# Altium schematic sheet [05] - POWER.SchDoc
size A3; CompanyName: FPT-FTI copporation; Address1: FPT Building Duy Tan; Address2: Floor 4,; DocumentNumber: 5; SheetNumber: 5; SheetTotal: 8; NameAuthor: Angle Vu
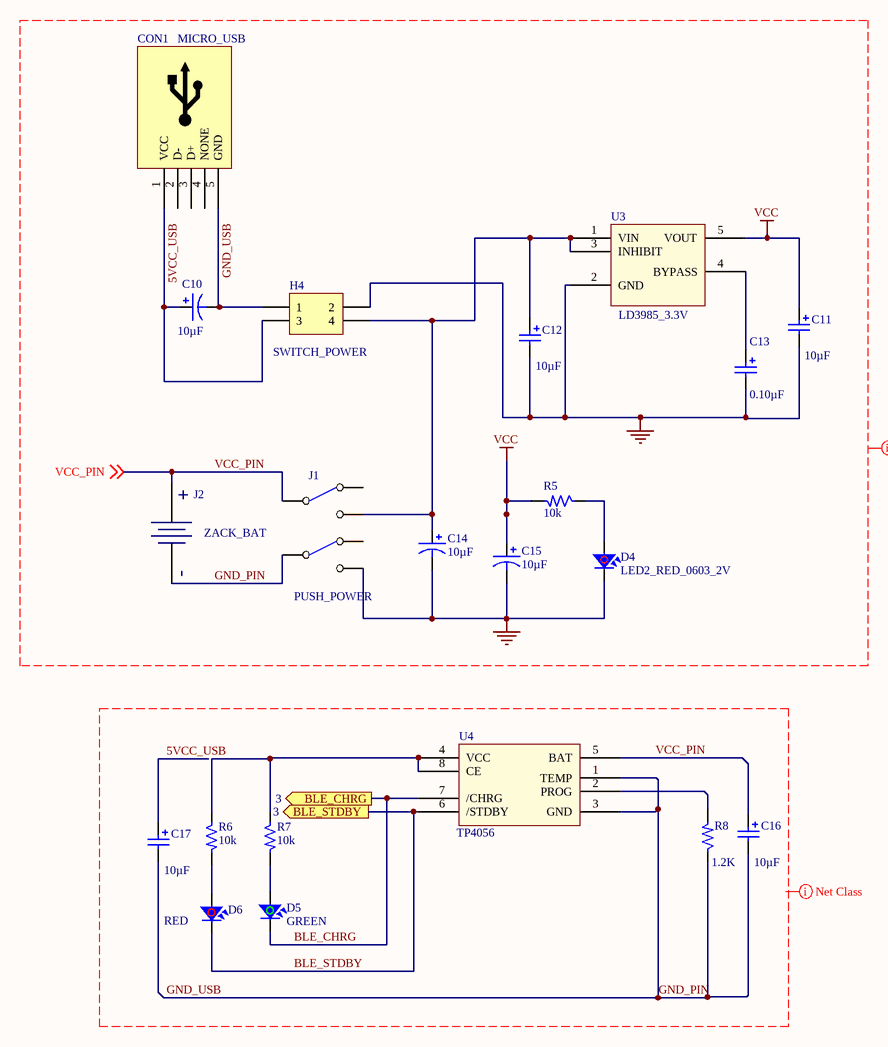
[diagram p0: [05] - POWER.SchDoc]

## Parts
C10  Capacitance: 10µF  [CAP_SMD0805 - TANTALUM]  (hidden comment: C_106_0805_TANTALUM_16V)
C11  Capacitance: 10µF  [CAP_SMD0805]  (hidden comment: C_106_0805_CERAMIC_16V)
C12  Capacitance: 10µF  [CAP_SMD0805]  (hidden comment: C_106_0805_CERAMIC_16V)
C13  Capacitance: 0.10µF  [CAP_SMD0603]  (hidden comment: C_104_0603_CERAMIC_16V)
C14  Capacitance: 10µF  [CAP_SMD0805 - TANTALUM]  (hidden comment: C_106_0805_TANTALUM_16V)
C15  Capacitance: 10µF  [CAP_SMD0805 - TANTALUM]  (hidden comment: C_106_0805_TANTALUM_16V)
C16  Capacitance: 10µF  [CAP_SMD0805]  (hidden comment: C_106_0805_CERAMIC_16V)
C17  Capacitance: 10µF  [CAP_SMD0805]  (hidden comment: C_106_0805_CERAMIC_16V)
CON1  MICRO_USB  [CON_MICRO_USB_HOLE]
D4  LED2_RED_0603_2V  [LED_RED_SMD0603]
D5  GREEN  [LED_GREEN_SMD0603]
D6  RED  [LED_RED_SMD0603]
H4  SWITCH_POWER  [HEADER2_MALE2_HOLE2.54]
J1  PUSH_POWER  [SW6_DPDT_POWER]
J2  ZACK_BAT  [ZACK_BAT]
R5  Resistance (Ohms): 10k  [RES_SMD0603]  (hidden comment: R_10K_SMD0603_1%_1/10W)
R6  Resistance (Ohms): 10k  [RES_SMD0603]  (hidden comment: R_10K_SMD0603_1%_1/10W)
R7  Resistance (Ohms): 10k  [RES_SMD0603]  (hidden comment: R_10K_SMD0603_1%_1/10W)
R8  Resistance (Ohms): 1.2K  [RES_SMD0603]  (hidden comment: R_1K2_SMD0603_1%_1/10W)
U3  LD3985_3.3V  [POWER_LDO_LDR3985-3.3]
U4  TP4056  [POWER__CHARGE_TP4056]

## Ports
BLE_CHRG (out, see 3), BLE_STDBY (out, see 3)

## Nets
GND: C11.2 C12.2 C13.2 C14.2 C15.2 D4.2 H4.2 J1.4(NO) U3.2(GND)
VCC: C11.1 C15.1 R5.2 U3.5(VOUT)
5VCC_USB: C10.1 C17.1 CON1.1(VCC) H4.3
BLE_CHRG: D5.2 U4.7(/CHRG) ; port BLE_CHRG
BLE_STDBY: D6.2 U4.6(/STDBY) ; port BLE_STDBY
GND_PIN: C10.2 C16.2 C17.2 CON1.5(GND) H4.1 J1.5(COMMON) J2.2(-) R8.1 U4.1(TEMP) U4.3(GND)  [also labelled GND_USB]
VCC_PIN: C16.1 J1.2(COMMON) J2.1(+) U4.5(BAT) ; off-sheet VCC_PIN
NetC12_1: C12.1 C14.1 H4.4 J1.3(NO) U3.1(VIN) U3.3(INHIBIT)
NetC13_1: C13.1 U3.4(BYPASS)
NetD4_1: D4.1 R5.1
NetD5_1: D5.1 R7.2
NetD6_1: D6.1 R6.2
NetR6_1: R6.1 R7.1 U4.4(VCC) U4.8(CE)
NetR8_2: R8.2 U4.2(PROG)

Not connected (* = marked no-connect by the designer): CON1 2(D-) 3(D+) 4(NONE); J1 1(NC) 6(NC)

## Layout directives
power charge: Undefined: 5VCC_USB, BLE_CHRG, BLE_STDBY, GND_PIN, GND_USB, VCC_PIN
power supply: Undefined: 5VCC_USB, GND, GND_PIN, GND_USB, VCC, VCC_PIN

## Notes on the sheet
- Designed By
- Checked By
- Company:
- Size:
- A3
- Address:
- Sheet:
- /

## Library data of the parts
C10 C14 C15 = C_106_0805_TANTALUM_16V: CAP TANT 10UF 16V 10% 0805; Manufacturer: AVX Corporation; Manufacturer Part Number: TPCR106K016R1800; Manufacturer Size Code: R; ESR (Equivalent Series Resistance): 1.8 Ohm; Type: Molded; Supplier 1: Digi-Key; RoHS: RoHS Compliant; Category: Capacitors; Stock 1: 7500; Pricing 1: 2500=1.404, 5000=1.377, 12500=1.3392, 25000=1.323, 62500=1.296 (USD); Packaging: Tape & Reel (TR); Part Status: Active; Tolerance: ±10%; Voltage - Rated: 16V; Operating Temperature: -55°C ~ 125°C; Mounting Type: Surface Mount; Package / Case: 0805 (2012 Metric); Size / Dimension: 0.079" L x 0.053" W (2.00mm x 1.35mm); Height - Seated (Max): 0.059" (1.50mm); Lead Spacing: -; Features: General Purpose; Lifetime @ Temp.: -; ComponentLink1URL: http://datasheets.avx.com/TPC.pdf; ComponentLink1Description: http://datasheets.avx.com/TPC.pdf; Supplier Part Number 1: 478-9014-2-ND
C11 C12 C16 C17 = C_106_0805_CERAMIC_16V: CAP CER 10UF 16V X5R 0805; Manufacturer: Murata Electronics North America; Manufacturer Part Number: GRM21BR61C106KE15K; Tolerance: ±10%; Supplier 1: Digi-Key; RoHS: RoHS Compliant; Category: Capacitors; Stock 1: 106329; Pricing 1: 1=0.19, 10=0.13, 50=0.0748, 100=0.0618, 250=0.052, 500=0.04356, 1000=0.03575, 5000=0.03023 (USD); Packaging: Cut Tape (CT); Part Status: Active; Voltage - Rated: 16V; Temperature Coefficient: X5R; Mounting Type: Surface Mount, MLCC; Operating Temperature: -55°C ~ 85°C; Applications: General Purpose; Ratings: -; Package / Case: 0805 (2012 Metric); Size / Dimension: 0.079" L x 0.049" W (2.00mm x 1.25mm); Height - Seated (Max): -; Thickness (Max): 0.053" (1.35mm); Lead Spacing: -; Features: -; Lead Style: -; ComponentLink1URL: http://www.murata.com/~/media/webrenewal/support/library/catalog/products/capacitor/mlcc/c02e.pdf; ComponentLink1Description: http://www.murata.com/~/media/webrenewal/support/library/catalog/products/capacitor/mlcc/c02e.pdf; Supplier Part Number 1: 490-6473-1-ND
C13 = C_104_0603_CERAMIC_16V: CAP CER 0.1UF 16V X7R 0603; Manufacturer: Murata Electronics North America; Manufacturer Part Number: GRM188R71C104KA01D; Tolerance: ±10%; Supplier 1: Digi-Key; RoHS: RoHS Compliant; Category: Capacitors; Stock 1: 3132000; Pricing 1: 4000=0.00359, 8000=0.00328, 12000=0.00312, 28000=0.00296, 100000=0.00215 (USD); Packaging: Tape & Reel (TR); Part Status: Active; Voltage - Rated: 16V; Temperature Coefficient: X7R; Mounting Type: Surface Mount, MLCC; Operating Temperature: -55°C ~ 125°C; Applications: General Purpose; Ratings: -; Package / Case: 0603 (1608 Metric); Size / Dimension: 0.063" L x 0.031" W (1.60mm x 0.80mm); Height - Seated (Max): -; Thickness (Max): 0.035" (0.90mm); Lead Spacing: -; Features: -; Lead Style: -; ComponentLink1URL: http://www.murata.com/~/media/webrenewal/support/library/catalog/products/capacitor/mlcc/c02e.pdf; ComponentLink1Description: http://www.murata.com/~/media/webrenewal/support/library/catalog/products/capacitor/mlcc/c02e.pdf; Supplier Part Number 1: 490-1532-2-ND
CON1 = CONNECT_MICRO_USB_SURFACE: CONN RCPT STD MICRO USB TYPE B; Manufacturer: Amphenol FCI; Manufacturer Part Number: 10103593-0001LF; Connector Type: USB - micro B; Number of Contacts: 5; Gender: Receptacle; Specifications: USB 2.0; Regulator Topology: Positive Fixed; Voltage - Output: 3.3V; Current - Output: 150mA; Voltage - Dropout (Typical): 0.06V @ 150mA; Number of Regulators: 1; Voltage - Input: Up to 6V; Current - Limit (Min): 300mA; RoHS: RoHS Compliant; Category: Connectors, Interconnects; Packaging: Digi-Reel®; Part Status: Active; Mounting Type: Board Cutout, Surface Mount, Right Angle; Features: Shielded, Solder Retention; Ingress Protection: -; ComponentLink1URL: http://portal.fciconnect.com/Comergent//fci/drawing/10103593.pdf; ComponentLink1Description: http://portal.fciconnect.com/Comergent//fci/drawing/10103593.pdf; Operating Temperature: -40°C ~ 125°C; Package / Case: SC-74A, SOT-753; Supplier Device Package: SOT-23-5; ComponentLink2URL: http://www.st.com/web/en/resource/technical/document/datasheet/CD00003395.pdf; ComponentLink2Description: http://www.st.com/web/en/resource/technical/document/datasheet/CD00003395.pdf; Supplier 1: Digi-Key; Stock 1: 4000; Pricing 1: 1000=0.36878, 2000=0.3576, 3000=0.33525, 5000=0.32408, 10000=0.30173, 25000=0.29055 (USD); Supplier Part Number 1: 609-4049-2-ND
D4 D6 = LED2_RED_0603_2V: LED RED CLEAR 0603 SMD; Manufacturer: Lite-On Inc.; Manufacturer Part Number: LTST-C191KRKT; Lens Color: Colorless; Millicandela Rating: 54mcd; Lens Style/Size: Rectangle with Flat Top, 1.10mm x 0.80mm; Voltage - Forward (Vf) (Typ): 2V; Current - Test: 20mA; Viewing Angle: 130°; Wavelength - Dominant: 631nm; Wavelength - Peak: 639nm; Supplier 1: Digi-Key; RoHS: RoHS Compliant; Category: Optoelectronics; Stock 1: 680000; Pricing 1: 5000=0.0404, 10000=0.03636, 25000=0.03232, 50000=0.02929, 125000=0.02727 (USD); Packaging: Tape & Reel (TR); Part Status: Active; Color: Red; Lens Transparency: Clear; Mounting Type: Surface Mount; Features: -; Package / Case: 0603 (1608 Metric); Supplier Device Package: *; Size / Dimension: 1.60mm L x 0.80mm W; Height (Max): 0.55mm; ComponentLink1URL: http://optoelectronics.liteon.com/upload/download/DS22-2000-223/S_110_LTST-C191KRKT.pdf; ComponentLink1Description: http://optoelectronics.liteon.com/upload/download/DS22-2000-223/S_110_LTST-C191KRKT.pdf; Supplier Part Number 1: 160-1447-2-ND
D5 = LED2_GREEN_0603_2V: LED GREEN CLEAR 0603 SMD; Manufacturer: Lite-On Inc.; Manufacturer Part Number: LTST-C191KGKT; Lens Color: Colorless; Millicandela Rating: 35mcd; Lens Style/Size: Rectangle with Flat Top, 1.10mm x 0.80mm; Voltage - Forward (Vf) (Typ): 2V; Current - Test: 20mA; Viewing Angle: 130°; Wavelength - Dominant: 571nm; Wavelength - Peak: 574nm; Supplier 1: Digi-Key; RoHS: RoHS Compliant; Category: Optoelectronics; Stock 1: 960000; Pricing 1: 5000=0.0404, 10000=0.03636, 25000=0.03232, 50000=0.02929, 125000=0.02727 (USD); Packaging: Tape & Reel (TR); Part Status: Active; Color: Green; Lens Transparency: Clear; Mounting Type: Surface Mount; Features: -; Package / Case: 0603 (1608 Metric); Supplier Device Package: *; Size / Dimension: 1.60mm L x 0.80mm W; Height (Max): 0.55mm; ComponentLink1URL: http://optoelectronics.liteon.com/upload/download/DS22-2000-228/S_110_LTST-C191KGKT.pdf; ComponentLink1Description: http://optoelectronics.liteon.com/upload/download/DS22-2000-228/S_110_LTST-C191KGKT.pdf; Supplier Part Number 1: 160-1446-2-ND
H4 = HEADER2_MALE2_SURFACE_2.54_6.1MM: CONN HEADER 4POS TIN SMD; Manufacturer: Molex, LLC; Manufacturer Part Number: 0015912040; Connector Type: Header, Unshrouded, Breakaway; Number of Positions: 4; Number of Positions Loaded: All; Pitch: 0.100" (2.54mm); Supplier 1: Digi-Key; RoHS: RoHS Compliant; Category: Connectors, Interconnects; Stock 1: 10914; Pricing 1: 1=0.44, 10=0.42, 25=0.3596, 50=0.3058, 100=0.2938, 250=0.2638, 500=0.2518, 1000=0.20983, 2500=0.19184 (USD); Packaging: Bulk; Part Status: Active; Contact Type: Male Pin; Number of Rows: 2; Row Spacing: 0.100" (2.54mm); Contact Mating Length: 0.240" (6.10mm); Mounting Type: Surface Mount; Termination: Solder; Fastening Type: -; Features: -; Contact Finish: Tin; Contact Finish Thickness: 150µin (3.81µm); Color: Black; ComponentLink1URL: http://www.molex.com/pdm_docs/sd/015912040_sd.pdf; ComponentLink1Description: http://www.molex.com/pdm_docs/sd/015912040_sd.pdf; Supplier Part Number 1: WM9514-ND
J1 = SW6_DPDT_HOLE_PUSH_0.1A_30A: SWITCH PUSH DPDT 0.1A 30V; Manufacturer: Apem Inc.; Manufacturer Part Number: MHPS2266; Switch Function: On-On; Current Rating: 100mA (DC); Actuator Type: Plunger for Cap; Electrical Life: 10,000 Cycles; Supplier 1: Digi-Key; RoHS: RoHS Compliant; Category: Switches; Stock 1: 2279; Pricing 1: 1=1.33, 10=1.243, 25=1.184, 50=1.1248, 100=1.0952, 250=1.0656, 500=1.0064, 1000=0.9472, 2500=0.8584 (USD); Packaging: Bulk; Part Status: Active; Type: Keyswitch; Circuit: DPDT; Voltage Rating - AC: -; Voltage Rating - DC: 30V; Color - Actuator/Cap: -; Illumination Type, Color: -; Illumination Voltage (Nominal): -; Mounting Type: Through Hole; Termination Style: PC Pin; Ingress Protection: -; Features: -; Panel Cutout Dimensions: -; Operating Temperature: -20°C ~ 65°C; Mechanical Life: -; ComponentLink1URL: http://www.apem.com/files/apem/brochures/MHPS_Q42014.pdf; ComponentLink1Description: http://www.apem.com/files/apem/brochures/MHPS_Q42014.pdf; Supplier Part Number 1: 679-3528-ND
J2 = ZACK2_HOLE_BATTERY_LOCK: CONN HEADER VERT 2POS .100 TIN; Manufacturer: TE Connectivity AMP Connectors; Manufacturer Part Number: 640456-2; Connector Type: Header, Unshrouded; Number of Positions: 2; Number of Positions Loaded: All; Pitch: 0.100" (2.54mm); Supplier 1: Digi-Key; RoHS: RoHS Compliant; Category: Connectors, Interconnects; Stock 1: 136186; Pricing 1: 1=0.12, 10=0.083, 100=0.069, 500=0.066, 1000=0.058, 2000=0.052, 5000=0.05, 10000=0.041 (USD); Packaging: Bulk; Part Status: Active; Contact Type: Male Pin; Number of Rows: 1; Row Spacing: -; Contact Mating Length: 0.295" (7.49mm); Mounting Type: Through Hole; Termination: Solder; Fastening Type: Friction Lock; Features: -; Contact Finish: Tin; Contact Finish Thickness: -; Color: Natural; ComponentLink1URL: http://www.te.com/commerce/DocumentDelivery/DDEController?Action=srchrtrv&DocNm=640456&DocType=Customer+Drawing&DocLang=English; ComponentLink1Description: http://www.te.com/commerce/DocumentDelivery/DDEController?Action=srchrtrv&DocNm=640456&DocType=Customer+Drawing&DocLang=English; Supplier Part Number 1: A1921-ND
R5-R7 = R_10K_SMD0603_1%_1/10W: RES SMD 10K OHM 1% 1/10W 0603; Manufacturer: Yageo; Manufacturer Part Number: RC0603FR-0710KL; Power (Watts): 0.1W, 1/10W; Temperature Coefficient: ±100ppm/°C; Capacitance: 0.10µF; Voltage - Rated: 50V; Supplier 1: Digi-Key; RoHS: RoHS Compliant; Category: Resistors; Stock 1: 10005000; Pricing 1: 5000=0.00167, 10000=0.00145, 25000=0.00128, 50000=0.00117, 125000=0.00115 (USD); Packaging: Tape & Reel (TR); Part Status: Active; Tolerance: ±1%; Composition: Thick Film; Features: Moisture Resistant; Operating Temperature: -55°C ~ 155°C; Package / Case: 0603 (1608 Metric); Supplier Device Package: 0603; Size / Dimension: 0.063" L x 0.031" W (1.60mm x 0.80mm); Height: 0.022" (0.55mm); Number of Terminations: 2; ComponentLink1URL: http://www.yageo.com/documents/recent/PYu-RC_Group_51_RoHS_L_04.pdf; ComponentLink1Description: http://www.yageo.com/documents/recent/PYu-RC_Group_51_RoHS_L_04.pdf; Supplier Part Number 1: 311-10.0KHRTR-ND; Mounting Type: Surface Mount, MLCC; Applications: General Purpose; Ratings: -; Height - Seated (Max): -; Thickness (Max): 0.037" (0.94mm); Lead Spacing: -; Lead Style: -; ComponentLink2URL: http://datasheets.avx.com/X7RDielectric.pdf; ComponentLink2Description: http://datasheets.avx.com/X7RDielectric.pdf
R8 = R_1K2_SMD0603_1%_1/10W: RES SMD 1.2K OHM 1% 1/10W 0603; Manufacturer: Yageo; Manufacturer Part Number: RC0603FR-071K2L; Power (Watts): 0.1W, 1/10W; Temperature Coefficient: ±100ppm/°C; Supplier 1: Digi-Key; RoHS: RoHS Compliant; Category: Resistors; Stock 1: 560000; Pricing 1: 5000=0.00167, 10000=0.00145, 25000=0.00128, 50000=0.00117, 125000=0.00115 (USD); Packaging: Tape & Reel (TR); Part Status: Active; Tolerance: ±1%; Composition: Thick Film; Features: Moisture Resistant; Operating Temperature: -55°C ~ 155°C; Package / Case: 0603 (1608 Metric); Supplier Device Package: 0603; Size / Dimension: 0.063" L x 0.031" W (1.60mm x 0.80mm); Height: 0.022" (0.55mm); Number of Terminations: 2; ComponentLink1URL: http://www.yageo.com/documents/recent/PYu-RC_Group_51_RoHS_L_04.pdf; ComponentLink1Description: http://www.yageo.com/documents/recent/PYu-RC_Group_51_RoHS_L_04.pdf; Supplier Part Number 1: 311-1.20KHRTR-ND
U3 = POWER_LDO_LD3985_3.3V_SOT-23-5: IC REG LDO 3.3V 0.15A SOT23-5; Manufacturer: STMicroelectronics; Manufacturer Part Number: LD3985M33R; Regulator Topology: Positive Fixed; Current - Output: 150mA; Voltage - Dropout (Typical): 0.06V @ 150mA; Number of Regulators: 1; Voltage - Input: Up to 6V; Current - Limit (Min): 300mA; Supplier 1: Digi-Key; RoHS: RoHS Compliant; Category: Integrated Circuits (ICs); Stock 1: 6000; Pricing 1: 3000=0.2294, 6000=0.2146, 15000=0.1998, 30000=0.18944, 75000=0.185, 150000=0.1776 (USD); Packaging: Tape & Reel (TR); Part Status: Active; Voltage - Output: 3.3V; Operating Temperature: -40°C ~ 125°C; Mounting Type: Surface Mount; Package / Case: SC-74A, SOT-753; Supplier Device Package: SOT-23-5; ComponentLink1URL: http://www.st.com/web/en/resource/technical/document/datasheet/CD00003395.pdf; ComponentLink1Description: http://www.st.com/web/en/resource/technical/document/datasheet/CD00003395.pdf; Supplier Part Number 1: 497-3504-2-ND
U4 = POWER_CHARGE_TP4056_4.2V_SOP8: IC CHARGR BATTERY L-ION  SOP8; Manufacturer: NanJing; Battery Chemistry: Lithium-Ion; Number of Cells: 1; Current - Charging: Constant - Programmable; Programmable Features: Timer; Fault Protection: Over Current, Over Temperature; Charge Current - Max: 700mA; Battery Pack Voltage: 4.2V; Voltage - Supply (Max): 8V; Supply: TAOBAO; Manufacturer Part Number: TP4056; RoHS: RoHS Compliant; Category: Integrated Circuits (ICs); Stock 1: 0; Pricing 1: 500=1.76 (USD); Packaging: Tape & Reel (TR); Part Status: Active; Interface: -; Operating Temperature: -40°C ~ 85°C (TA); Package / Case: SOP8; Supplier Device Package: SOP8; ComponentLink1URL: http://www.linear.com/docs/3854; ComponentLink1Description: http://www.linear.com/docs/3854